# EAGLE schematic ws (EAGLE 7.4.0)
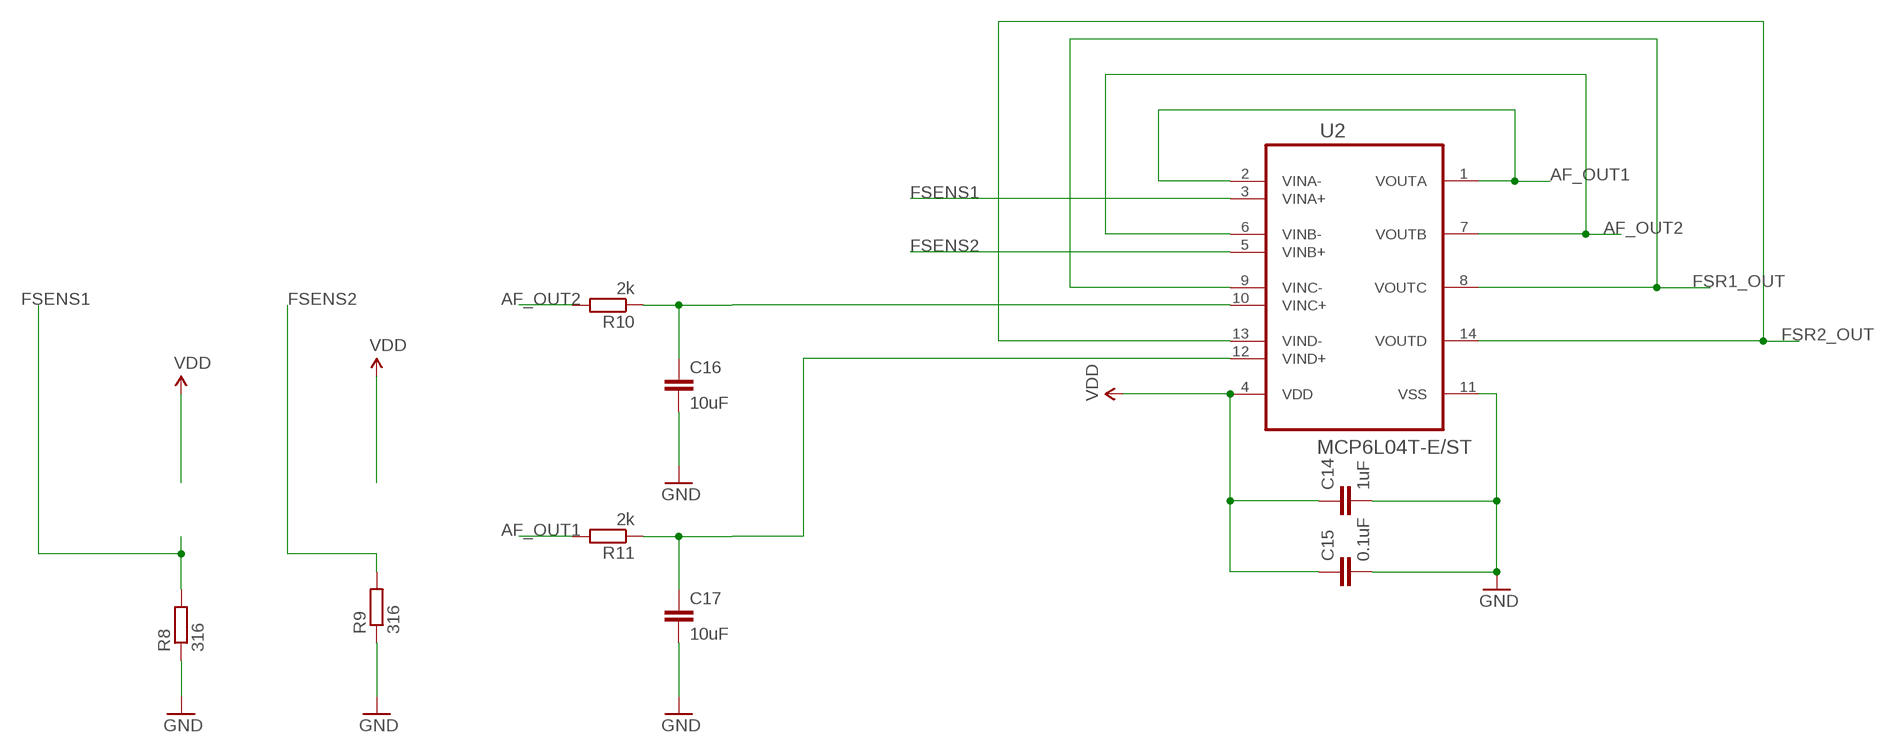
[diagram p0: schematic, sheet 1]

## Parts
C14  1uF  C-EUC0402  [C0402]
C15  0.1uF  C-EUC0402  [C0402]
C16  10uF  C-EUC0402  [C0402]
C17  10uF  C-EUC0402  [C0402]
R8  316  R-EU_R0402  [R0402]
R9  316  R-EU_R0402  [R0402]
R10  2k  R-EU_R0402  [R0402]
R11  2k  R-EU_R0402  [R0402]
U2  MCP6L04T-E/ST  [SOP65P640X120-14N]

## Nets
AF_OUT1: R11.2 U2.1(VOUTA) U2.2(VINA-)
AF_OUT2: R10.2 U2.6(VINB-) U2.7(VOUTB)
FSENS1: R8.2 U2.3(VINA+)
FSENS2: R9.2 U2.5(VINB+)
FSR1_OUT: U2.8(VOUTC) U2.9(VINC-)
FSR2_OUT: U2.13(VIND-) U2.14(VOUTD)
GND: C14.2 C15.2 C16.2 C17.2 R8.1 R9.1 U2.11(VSS)
N$8: C16.1 R10.1 U2.10(VINC+)
N$9: C17.1 R11.1 U2.12(VIND+)
VDD: C14.1 C15.1 U2.4(VDD)

## Library data of the parts
C14-C17 = rcl:C-EU: CAPACITOR, European symbol
R8-R11 = rcl:R-EU_: RESISTOR, European symbol
U2 = MCP6L04:MCP6L04T-E/ST: IC, 1 MHz, 85 uA Quad Op Amps, 1.8V, 14-TSSOP; MPN: MCP6L04T-E/ST; OC_FARNELL: 1852143; OC_NEWARK: 08R1815; PACKAGE: TSSOP-14; SUPPLIER: Microchip